# EAGLE design EBR01_1 (EAGLE 7.4.0)
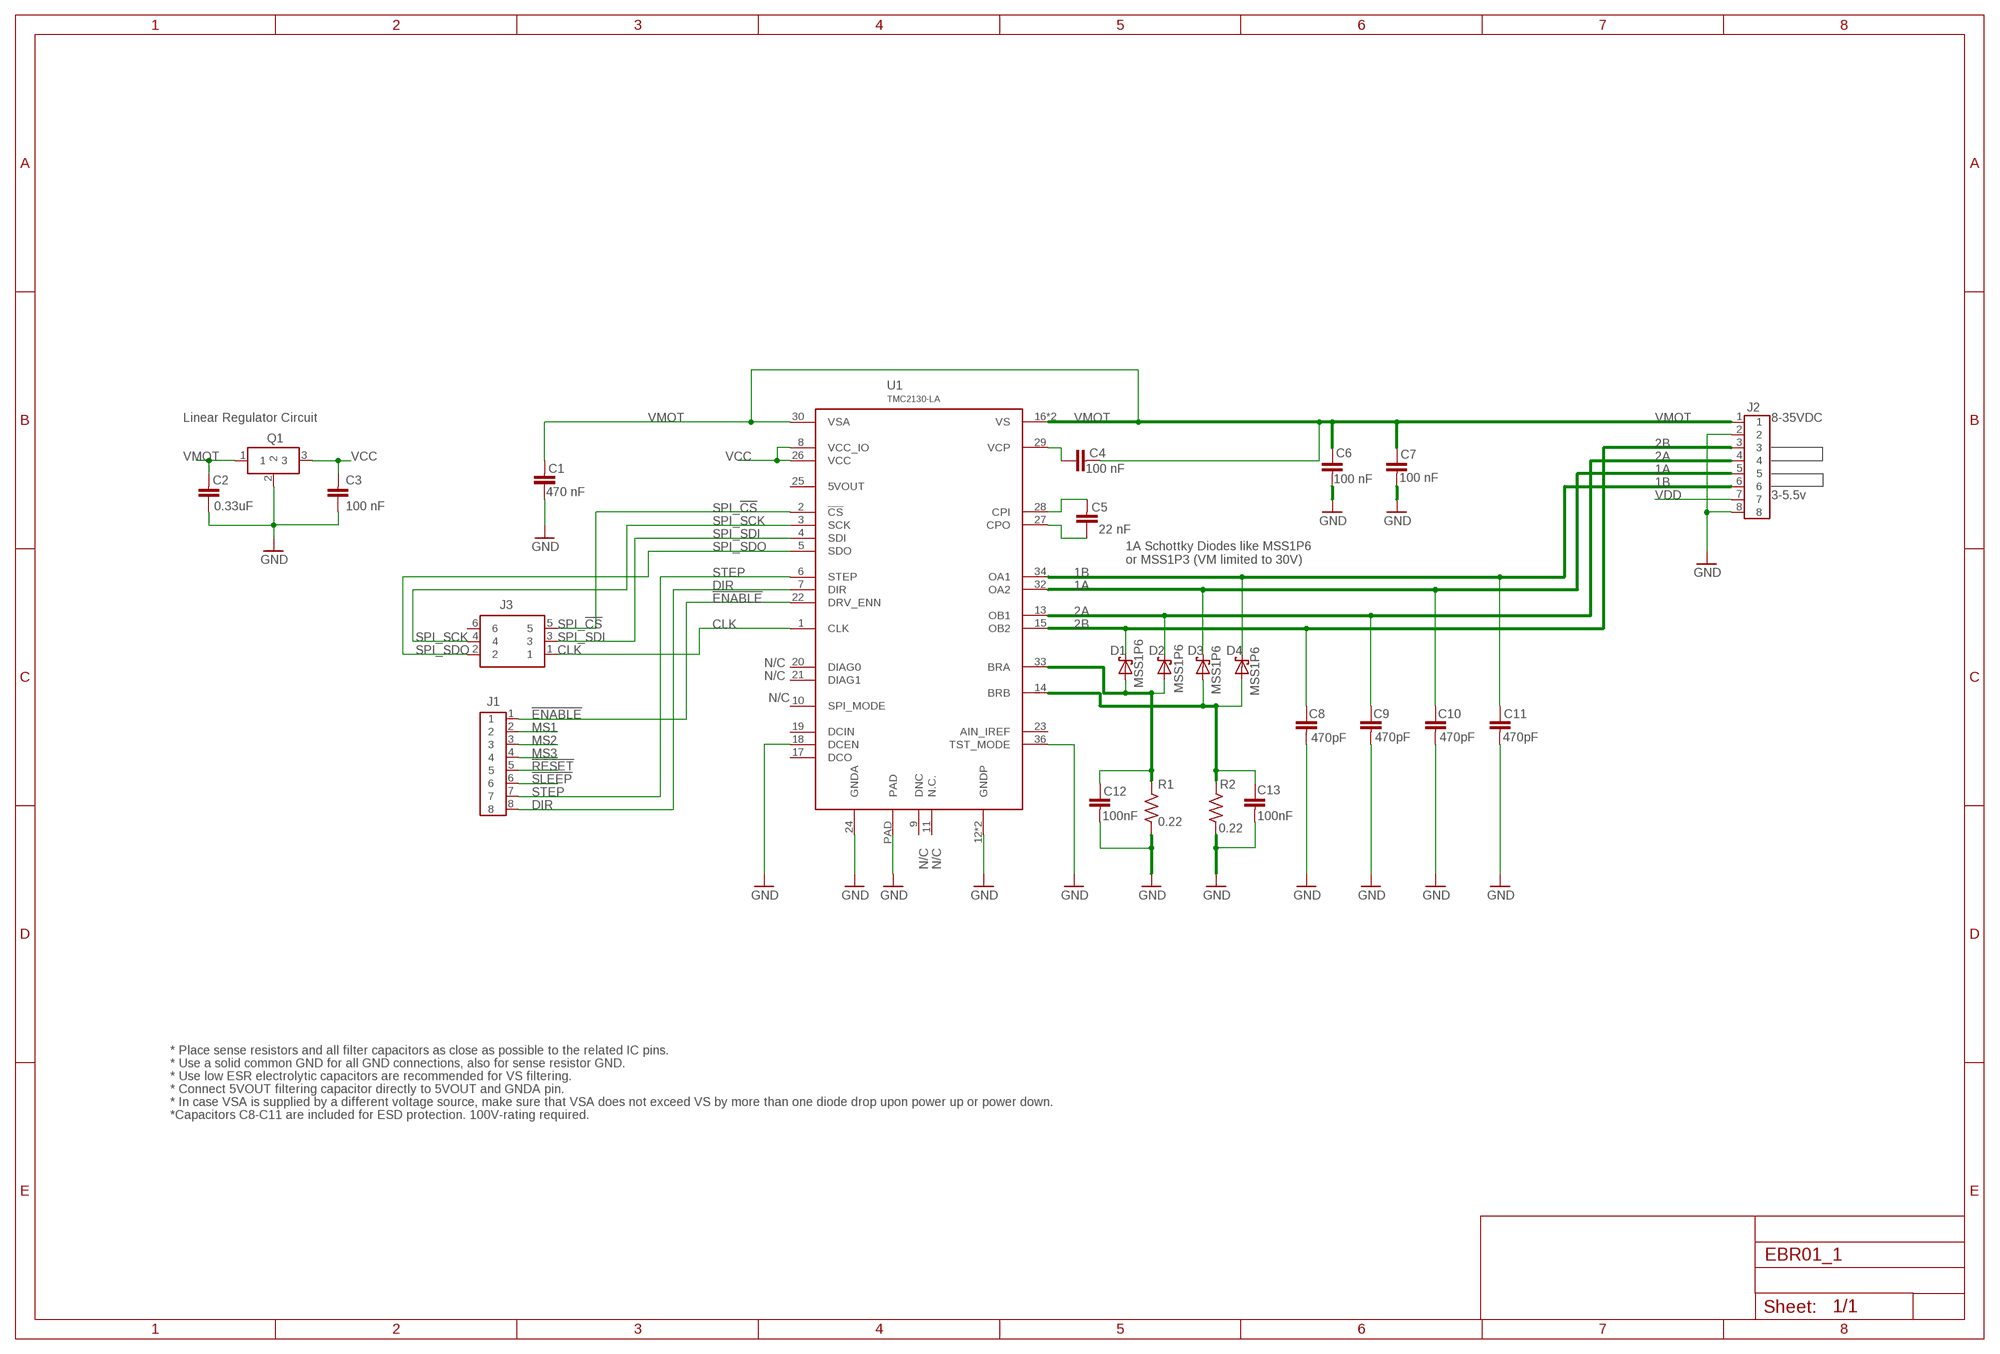
[diagram p0: schematic, sheet 1]

## Parts
C1  470 nF  CPL-CAP-X7R-0603-0.47UF-35V  [C0603]
C2  0.33uF  CPL-CAP-X7R-0603-0.33UF-35V  [C0603]
C3  100 nF  CPL-CAP-X7R-0603-100NF-50V  [C0603]
C4  100 nF  CPL-CAP-X7R-0603-100NF-100V  [C0603]
C5  22 nF  CPL-CAP-X7R-0603-22NF-50V"  [C0603]
C6  100 nF  CPL-CAP-X7R-0603-100NF-100V  [C0603]
C7  100 nF  CPL-CAP-X7R-0603-100NF-100V  [C0603]
C8  470pF  CPL-CAP-X7R-0603-470PF-100V  [C0603]
C9  470pF  CPL-CAP-X7R-0603-470PF-100V  [C0603]
C10  470pF  CPL-CAP-X7R-0603-470PF-100V  [C0603]
C11  470pF  CPL-CAP-X7R-0603-470PF-100V  [C0603]
C12  100nF  CPL-CAP-X7R-0603-100NF-50V  [C0603]
C13  100nF  CPL-CAP-X7R-0603-100NF-50V  [C0603]
D1  MSS1P6  CPL-DIO-MSS1P6-MICROSMP  [MICRO-SMP]
D2  MSS1P6  CPL-DIO-MSS1P6-MICROSMP  [MICRO-SMP]
D3  MSS1P6  CPL-DIO-MSS1P6-MICROSMP  [MICRO-SMP]
D4  MSS1P6  CPL-DIO-MSS1P6-MICROSMP  [MICRO-SMP]
J1  CPL-CON-HEADER-0.1IN-8P-M  [CON-HDR-8POS-MALE]
J2  CPL-CON-HEADER-0.1IN-8P-M  [CON-HDR-8POS-MALE]
J3  CPL-CON-HEADER-0.1IN-2X3P-M  [CON-HDR-2X3P]
Q1  CPL-REG-LIN-5V-0.1A  [SOT-89]
R1  0.22  CPL-RES-1206-0.22-0.5W  [R1206]
R2  0.22  CPL-RES-1206-0.22-0.5W  [R1206]
U1  TMC2130-LA  CPL-MDR-2PHSTEPPER  [QFN36-(5X6)]

## Nets
1A: C10.1 D3.NEG(C) J2.5 U1.32(OA2)
1B: C11.1 D4.NEG(C) J2.6 U1.34(OA1)
2A: C9.1 D2.NEG(C) J2.4 U1.13(OB1)
2B: C8.1 D1.NEG(C) J2.3 U1.15(OB2)
!ENABLE!: J1.1 U1.22(DRV_ENN)
!RESET!: J1.5
!SLEEP!: J1.6
BRA: C12.1 D1.POS(A) D2.POS(A) R1.2 U1.33(BRA)
BRB: C13.1 D3.POS(A) D4.POS(A) R2.2 U1.14(BRB)
CLK: J3.1 U1.1(CLK)
CPI: C5.2 U1.28(CPI)
CPO: C5.1 U1.27(CPO)
DIR: J1.8 U1.7(DIR)
GND: C1.1 C2.1 C3.1 C6.2 C7.2 C8.2 C9.2 C10.2 C11.2 C12.2 C13.2 J2.2 J2.8 Q1.2 R1.1 R2.1 U1.12(GNDP) U1.18(DCEN) U1.24(GNDA) U1.35(GNDP) U1.36(TST_MODE) U1.PAD
MS1: J1.2
MS2: J1.3
MS3: J1.4
SPI_!CS!: J3.5 U1.2(!CS)
SPI_SCK: J3.4 U1.3(SCK)
SPI_SDI: J3.3 U1.4(SDI)
SPI_SDO: J3.2 U1.5(SDO)
STEP: J1.7 U1.6(STEP)
VCC: C3.2 Q1.3 U1.8(VCC_IO) U1.26(VCC)
VCP: C4.1 U1.29(VCP)
VDD: J2.7
VMOT: C1.2 C2.2 C4.2 C6.1 C7.1 J2.1 Q1.1 U1.16(VS) U1.30(VSA) U1.31(VS)
Unconnected: J3.6 U1.9(DNC) U1.10(SPI_MODE) U1.11(N.C.) U1.17(DCO) U1.19(DCIN) U1.20(DIAG0) U1.21(DIAG1) U1.23(AIN_IREF) U1.25(5VOUT)

## Notes on the sheet
- Linear Regulator Circuit | 8-35VDC
- 3-5.5v
- 1A Schottky Diodes like MSS1P6
  or MSS1P3 (VM limited to 30V)
- N/C
- N/C
- N/C
- N/C | N/C
- * Place sense resistors and all filter capacitors as close as possible to the related IC pins.
- * Use a solid common GND for all GND connections, also for sense resistor GND.
- * Use low ESR electrolytic capacitors are recommended for VS filtering.
- * Connect 5VOUT filtering capacitor directly to 5VOUT and GNDA pin.
- * In case VSA is supplied by a different voltage source, make sure that VSA does not exceed VS by more than one diode drop upon power up or power down.
- *Capacitors C8-C11 are included for ESD protection. 100V-rating required.

## Library data of the parts
C1 = TinWhiskers:CPL-CAP-X7R-0603-0.47UF-35V
C2 = TinWhiskers:CPL-CAP-X7R-0603-0.33UF-35V: Capacitor: 0.33uF, 35V, 10%, X7R; Package: 0603 Datasheet: http://product.tdk.com/en/catalog/datasheets/mlcc_commercial_general_en.pdf
C3 C12 C13 = TinWhiskers:CPL-CAP-X7R-0603-100NF-50V: Capacitor: 100nF, 50V, 10%; Package: 0603
C4 C6 C7 = TinWhiskers:CPL-CAP-X7R-0603-100NF-100V: Capacitor: 100nF, 100V, 10%; Package: 0603; Datasheet:
C5 = TinWhiskers:CPL-CAP-X7R-0603-22NF-50V: Capacitor Specs: 22nF, 50V, 10%, Package: 0603
C8-C11 = TinWhiskers:CPL-CAP-X7R-0603-470PF-100V: Capacitor: 470pF, 100V, 5%; Package: 0603 Datasheet: http://www.mouser.com/ds/2/427/vjw1bcbascomseries-223529.pdf
D1-D4 = TinWhiskers:CPL-DIO-MSS1P6-MICROSMP: Diode: Rectifier, 1A, 60V; Package: Micro-SMP; Datasheet: http://www.vishay.com/docs/89018/mss1p6.pdf
J1 J2 = TinWhiskers:CPL-CON-HEADER-0.1IN-8P-M
J3 = TinWhiskers:CPL-CON-HEADER-0.1IN-2X3P-M: Connector: 0.1" Pitch, 2x3P Datasheet: http://www.mouser.com/ds/2/418/NG_CD_825440_G_baseFilename-672958.pdf
Q1 = TinWhiskers:CPL-REG-LIN-5V-0.1A: Voltage Regulator: Vo=5V, Vin,max=30V, Io=0.1A; Package: SOT-89; Datasheet: http://www.mouser.com/ds/2/149/KA78L05A-185602.pdf
R1 R2 = TinWhiskers:CPL-RES-1206-0.22-0.5W: Resistor: 0.22 Ohm, 0.5W, 1%, 100 ppm/C Package: 1206 Datasheet: http://www.mouser.com/ds/2/427/rcwe-244377.pdf
U1 = TinWhiskers:CPL-MDR-2PHSTEPPER: Stepper Driver (Trinamic TMC2130-LA)

## Board
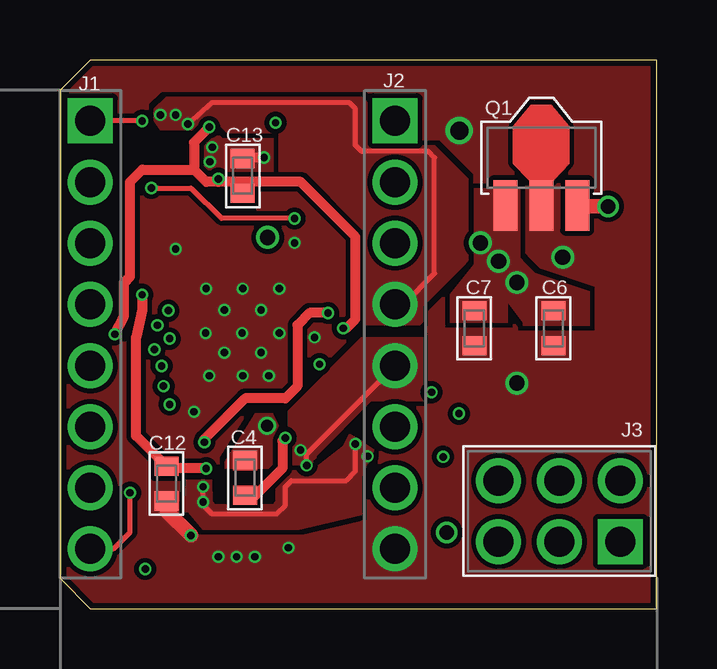
[diagram p1: board, top side]
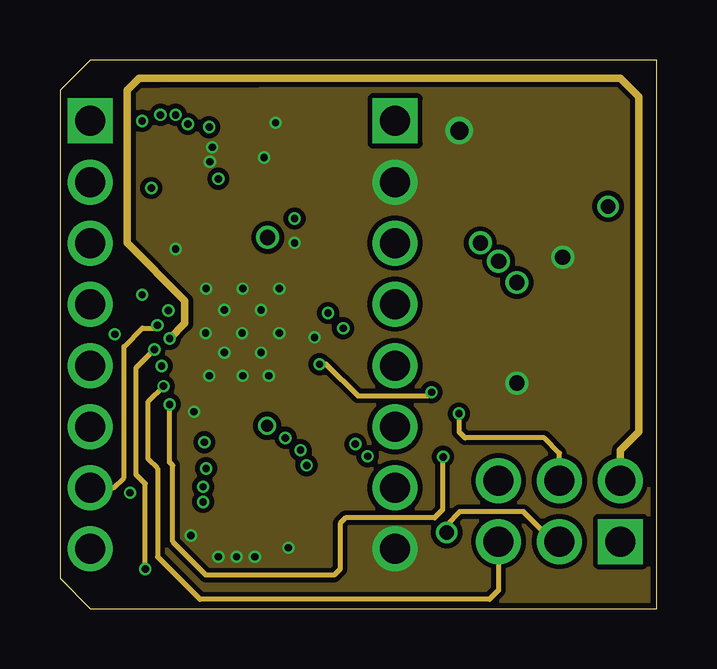
[diagram p2: board, inner layer GND]
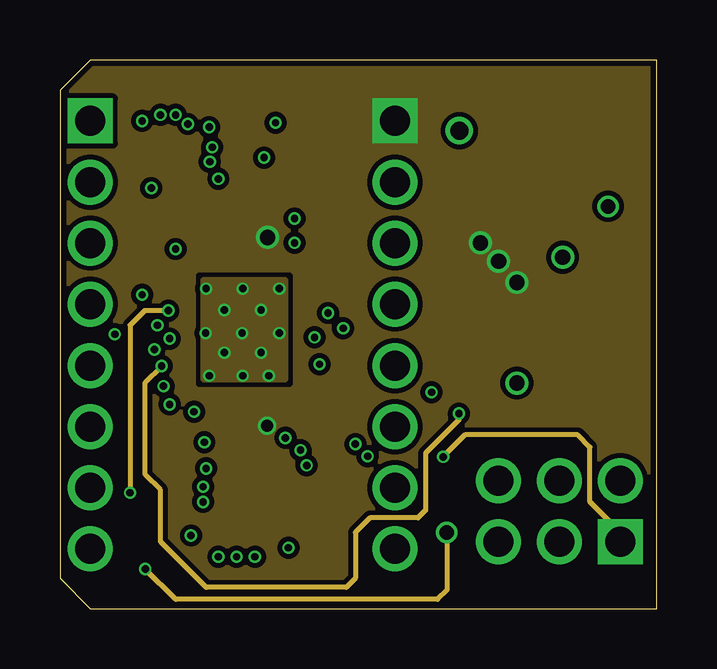
[diagram p3: board, inner layer VMOT]
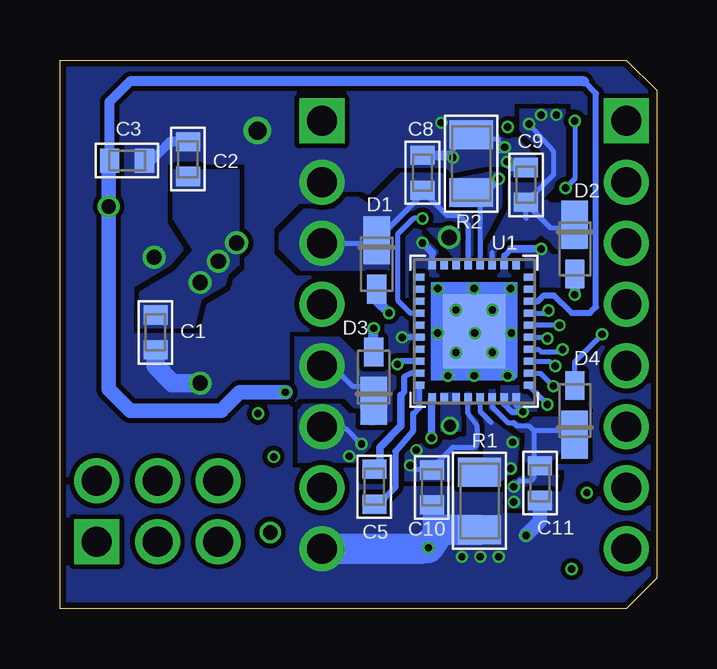
[diagram p4: board, bottom side, seen from below]

Size 24.89 x 22.86 mm. Coordinates in mm from the lower left corner, seen from the top.
Outline: 0,1.27 1.27,0 24.89,0 24.89,22.86 1.27,22.86 0,21.59 0,1.27
Copper layers (1*2*15*16): Top 0.035mm / dielectric 0.2mm / GND 0.0175mm / dielectric 0.3mm / VMOT 0.0175mm / dielectric 0.2mm / Bottom 0.035mm
Design rules "HQPCB_4layer_DRU_no_angle": minimum track width 6mil, minimum drill 12mil, track to track 8mil, track to pad 8mil, pad to pad 6mil, via to via 8mil, smd to smd 0mil, copper to edge 10mil, drill to drill 8mil, minimum pad ring 6mil, minimum via ring 4mil, stop-mask expansion 2mil, vias tented up to drill 100mil, thermal gap 10mil
tKeepout: area 3,7 to 12.2,16.3

### Footprints (pad centres in the part's own frame; a part is rotated, then mirrored left to right if it is on the bottom)
C0603 = smd 0.8 x 1: 1 -0.725,0; 2 0.725,0
MICRO-SMP = smd 2 x 1.1: NEG -1,0 | smd 1.2 x 0.8: POS 1.04,0
CON-HDR-8POS-MALE = drill 1.25 square: 1 -8.89,0 | drill 1.25: 2 -6.34,0; 3 -3.8,0; 4 -1.26,0; 5 1.31,0; 6 3.85,0; 7 6.39,0; 8 8.93,0
CON-HDR-2X3P = drill 1.25 square: 1 -2.54,1.27 | drill 1.25: 2 -2.54,-1.27; 3 0,1.27; 4 0,-1.27; 5 2.54,1.27; 6 2.54,-1.27
SOT-89 = smd 1 x 2.1: 1 -1.5,-2; 2 0,-2; 3 1.5,-2
R1206 = smd 1.2 x 1.8: 1 -1.2,0; 2 1.2,0
QFN36-(5X6) = smd 0.45 x 0.3: 1 -2.3,2.25; 2 -2.3,1.75; 3 -2.3,1.25; 4 -2.3,0.75; 5 -2.3,0.25; 6 -2.3,-0.25; 7 -2.3,-0.75; 8 -2.3,-1.25; 9 -2.3,-1.75; 10 -2.3,-2.25; 19 2.3,-2.25; 20 2.3,-1.75; 21 2.3,-1.25; 22 2.3,-0.75; 23 2.3,-0.25; 24 2.3,0.25; 25 2.3,0.75; 26 2.3,1.25; 27 2.3,1.75; 28 2.3,2.25 | smd 0.3 x 0.45: 11 -1.75,-2.8; 12 -1.25,-2.8; 13 -0.75,-2.8; 14 -0.25,-2.8; 15 0.25,-2.8; 16 0.75,-2.8; 17 1.25,-2.8; 18 1.75,-2.8; 29 1.75,2.8; 30 1.25,2.8; 31 0.75,2.8; 32 0.25,2.8; 33 -0.25,2.8; 34 -0.75,2.8; 35 -1.25,2.8; 36 -1.75,2.8 | smd 2.6 x 3.1: PAD 0,0

### Placement (x,y rotation side)
C1  20.91,11.51 90 bottom
C2  19.56,18.73 270 bottom
C3  22.1,18.67 180 bottom
C4  7.71,5.45 90 top
C5  11.79,5.08 270 bottom
C6  20.57,11.68 270 top
C7  17.27,11.68 270 top
C8  9.78,18.16 90 bottom
C9  5.46,17.65 90 bottom
C10  9.39,5.05 270 bottom
C11  4.88,5.23 270 bottom
C12  4.44,5.21 270 top
C13  7.62,18.03 90 top
D1  11.68,14.35 270 bottom
D2  3.43,14.99 270 bottom
D3  11.81,9.65 90 bottom
D4  3.43,8.26 90 bottom
J1  1.27,11.43 270 top
J2  13.97,11.43 270 top
J3  20.83,4.06 180 top
Q1  20.07,18.8 0 top
R1  7.4,4.49 90 bottom
R2  7.75,18.54 270 bottom
U1  7.62,11.56 180 bottom

### Tracks (layer width: path | path; a pad name or v marks a point on that pad's centre or on a via)
1A  (via drill 0.3)
  Top 0.203: v10.29,5.97 10.29,6.44 J2.5
  Bottom 0.203: U1.32 7.87,8.13 7.49,7.62 7.49,6.86 7.62,6.73 8.51,6.73 9.39,5.85 C10.1 10.1,5.78 v10.29,5.97 | D3.NEG 11.68,9.27 12.7,9.27 13.46,10.03 13.88,10.03
  other vias: 10.03,6.6
  pour Bottom (rank 2, no thermals): 7.75,9.02 8,9.02 8,7.24 8.26,7.11 9.91,6.86 10.54,6.48 10.54,5.33 8.64,5.33 8.51,5.46 8.51,6.48 7.37,6.48 7.37,7.75 7.75,8.13
  pour Top (rank 2, no thermals): 10.67,6.35 10.67,5.84 10.41,5.59 10.03,5.59 9.53,6.1 9.53,8.26 12.57,11.3 15.11,11.3 15.11,8.64 12.95,8.64
  pour Bottom (rank 3, no thermals): 12.45,10.54 13.21,11.3 15.11,11.3 15.11,8.64 12.95,8.64 11.94,7.62 10.79,7.87 10.79,9.91 11.43,10.54
1B  (via drill 0.3)
  Top 0.203: v5.97,5.08 5.97,4.32 6.35,3.94 9.02,3.94 9.4,4.32 9.4,5.08 9.65,5.33 11.94,5.33 12.32,5.71 v12.32,6.86
  Bottom 0.203: 6.86,8.74 U1.34 6.87,8.39 6.22,7.75 5.97,7.75 5.84,7.62 5.33,7.62 5.16,7.44 5.13,7.44 | 5.13,7.44 3.74,7.44 D4.NEG | v12.32,6.86 12.95,7.49 13.88,7.49 J2.6 | v5.97,5.08 5.71,5.33 5.26,5.33 5.13,5.46 5.13,5.7 C11.1 5.13,6.21 5.13,7.44
  other vias: 12.83,6.35 5.97,4.45
  pour Bottom (no thermals): 5.33,5.59 4.06,5.59 4.19,5.08 5.46,5.08 5.59,4.19 6.22,4.19 6.22,5.21 5.84,5.51 5.33,5.51
  pour Top (no thermals): 6.32,5.33 5.26,5.33 5.21,4.06 5.33,4.06 5.97,3.3 9.04,3.33 9.91,3.3 12.57,3.94 12.57,5.59 13.08,6.6 12.06,7.24 11.81,6.73 10.67,5.84 10.54,5.71 9.65,5.71 9.02,5.08 9.02,4.45 8.89,4.32 6.48,4.32 6.35,4.45
  pour Bottom (no thermals): 11.81,6.86 11.05,6.86 11.05,7.75 11.43,8.13 12.83,8.13 13.21,8.51 14.73,8.51 14.99,8.26 14.99,6.1 12.57,6.1
  pour Bottom (rank 2, no thermals): 6.6,9.02 7.11,9.02 7.11,8.13 6.35,7.37 5.59,7.37 5.46,7.24 5.46,6.22 4.45,6.22 3.68,6.99 3.68,7.87 5.97,7.87 6.6,8.51
2A  (via drill 0.3)
  Top 0.203: J2.4 14.34,12.69 15.62,13.97 15.62,18.8 15.37,19.05 12.57,19.05 12.32,19.3 12.32,20.83 12.06,21.08 6.35,21.08 v5.33,20.19
  Bottom 0.203: U1.13 6.87,14.85 | 5.46,16.26 C9.1 | C9.1 5.46,16.89 4.45,15.88 3.95,15.88 D2.NEG | v5.33,20.19 4.32,19.05 4.32,18.07 C9.1
  other vias: 4.83,20.57 4.19,20.57
  pour Bottom (no thermals): 6.73,14.35 6.99,14.35 6.99,14.99 6.1,16.64 4.83,16.64 4.83,15.75 5.21,15.37 6.1,15.37 6.73,14.86
  pour Bottom (no thermals): 4.57,17.02 6.22,17.02 6.22,15.88 5.08,15.88 4.19,14.99 3.05,14.99 3.05,16.89 4.45,16.89
  pour Bottom (no thermals): 6.22,17.02 6.22,17.65 6.1,17.78 4.95,17.78 4.83,17.91 4.83,19.05 5.71,19.94 5.71,20.83 3.81,20.83 3.81,18.03 4.83,17.02
  pour Top (rank 2, no thermals): 5.84,19.94 4.19,19.94 3.94,20.32 3.94,20.83 4.45,21.34 12.57,21.34 12.95,20.95 12.95,19.43 13.08,19.3 15.62,19.3 17.02,17.91 17.02,14.48 15.11,12.57 15.11,11.94 14.99,11.81 12.7,11.81 12.7,15.62 11.18,17.27 10.29,18.16 9.14,18.16 9.14,19.81 6.99,19.81 6.48,20.32 6.1,20.32 5.84,20.07
2B
  Bottom 0.203: J2.3 11.8,15.23 D1.NEG 9.78,17.26 | C8.1 9.78,17.26 | 9.78,17.26 9.64,17.26 8.76,16.38 8.26,16.38 7.87,16 U1.15
  pour Bottom (no thermals): 13.46,16.64 14.73,16.64 15.75,15.62 15.75,14.99 14.86,14.1 11.18,14.1 11.18,16.26 12.45,17.14 12.95,17.14
  pour Bottom (no thermals): 12.19,16.64 10.67,18.16 9.02,18.16 8.76,17.91 8.76,17.14 8.89,17.02 9.65,17.02 11.18,15.49 12.19,15.49
  pour Bottom (rank 2, no thermals): 7.62,14.22 8.13,14.22 8.13,15.88 8.26,16 9.27,16 10.67,17.4 10.67,17.53 10.03,18.16 9.4,18.16 8.76,17.53 8.76,16.76 8.64,16.64 7.87,16.64 7.49,16.26 7.49,15.75 7.62,15.62
!ENABLE!  (via drill 0.3)
  Top 0.203: v3.43,20.32 J1.1 | v9.78,16.26 6.73,16.26 5.46,17.53 v3.81,17.53
  Bottom 0.203: U1.22 10.28,12.31 10.79,12.83 10.79,15.62 10.16,16.26 v9.78,16.26 | v3.43,20.32 3.43,17.91 v3.81,17.53
BRA  (via drill 0.3)
  Top 0.203: 4.53,5.84 C12.1
  Top 0.406: v6.1,5.84 4.53,5.84 | C12.1 3.17,7.2 3.17,11.3 3.43,12.45 v3.43,13.08 | v11.18,12.32 10.41,12.32 9.91,11.81 9.91,9.27 9.4,8.76 7.72,8.76 6.02,7.06 v6.02,6.93
  Bottom 0.203: 6.91,6.18 R1.2 | 6.91,7.75 7.37,8.2 U1.33 | 3.3,13.82 D2.POS
  Bottom 0.406: D1.POS 11.68,12.83 v11.18,12.32 | D2.POS v3.43,13.08
  Bottom 0.61: 7.25,5.84 R1.2
  pour Bottom (no thermals): 7.24,8.13 5.84,7.11 5.71,7.11 5.84,5.84 6.6,5.21 8.26,5.21 8.26,6.22 7.24,6.22
BRB  (via drill 0.3)
  Top 0.406: v6.22,20.07 5.59,19.43 5.59,18.29 | 5.59,18.29 3.43,18.29 2.92,17.78 2.92,13.84 2.67,13.59 2.67,12.19 v2.29,11.43 | 7.49,17.78 10.03,17.78 12.32,15.49 12.32,12.06 11.94,11.68 v11.81,11.68 | C13.1 7.71,17.31 R2.2 7.75,17.53 7.49,17.78 | 7.49,17.78 6.6,17.78 | 6.6,17.78 6.1,17.78 5.59,18.29 | v6.6,17.91 6.6,17.78
  Bottom 0.203: D4.POS 3.43,10.29 v2.29,11.43 | U1.14 7.37,16.96 | 7.37,16.96 R2.2 | 7.37,16.96 7.37,17.52 7.12,17.52
  Bottom 0.406: D3.POS v11.81,11.68 | 7.12,17.52 v6.6,17.91
  pour Bottom (rank 3, no thermals): 7.11,14.73 7.49,14.73 7.62,16.51 7.75,16.64 8.51,16.64 8.64,16.76 8.64,17.78 8.51,17.91 6.6,18.29 6.35,18.03 6.35,16.64 7.11,14.86
CLK  (via drill 0.3)
  GND 0.203: v15.98,6.33 15.95,6.3 15.95,4.12 15.62,3.79 11.91,3.79 11.68,3.56 11.68,1.65 11.43,1.4 6.1,1.4 4.7,2.79 4.7,5.97 4.57,6.1 v4.57,8.51
  VMOT 0.203: J3.1 23.37,3.17 22.1,4.45 22.1,6.73 21.59,7.24 16.89,7.24 v15.98,6.33
  Bottom 0.203: U1.1 5.32,9.26 v4.57,8.51
CPI
  Bottom 0.203: C5.2 11.61,4.36
  Bottom 0.254: U1.28 9.92,8.37 10.16,8.13 10.16,7.42 10.91,6.54 10.91,5.05 11.61,4.36
CPO
  Bottom 0.203: 11.56,5.93 C5.1
  Bottom 0.254: 10.67,8.89 10.54,9.02 10.54,9.65 10.26,9.81 U1.27
  Bottom 0.305: 11.56,5.93 11.56,6.73 10.67,7.62 10.67,8.89
DIR  (via drill 0.3)
  Top 0.203: J1.8 2.25,2.5 2.92,3.17 v2.92,4.83
  VMOT 0.203: v2.92,4.83 2.92,11.81 3.53,12.42 v4.52,12.42
  Bottom 0.203: 5.31,12.32 U1.7 4.63,12.31 v4.52,12.42
GND  (via drill 0.3, 0.64, 0.76)
  Top 0.203: 7.66,18.8 C13.2
  Top 0.406: v8.51,18.8 7.66,18.8
  Top 0.61: C12.2 4.44,4.07 v5.46,3.05
  Bottom 0.203: 9.14,4.08 C10.2 | v10.61,11.31 v10.62,11.3 | v16.66,19.91 16.66,19.91 | v7.62,13.34 U1.PAD 7.62,11.51 v7.59,11.48 | v8.51,18.8 8.51,19.3 8.07,19.74 R2.1 7.56,19.56 6.6,19.56 6.6,19.05 | 5.33,18.41 5.37,18.38 C9.2 5.5,18.41
  Bottom 0.254: 6.37,8.66 U1.35 6.37,8.53 6.04,8.2 v5.59,8.2 5.87,8.49 U1.36 | U1.12 6.37,14.71 6.1,14.99 | U1.18 9.37,14.83 | U1.24 v10.61,11.31
  Bottom 0.305: 6.1,14.99 v4.83,14.99 | 9.37,14.83 v9.78,15.24
  Bottom 0.406: 5.5,18.41 6.04,18.41 v6.25,18.62 | C8.2 8.6,18.89 v8.51,18.8 | C2.1 20.3,19.45 21.08,18.67 C3.1
  Bottom 0.61: C11.2 4.88,3.63 v5.46,3.05
  Bottom 0.762: C1.1 20.91,10.11 20.19,9.4 v19.05,9.4 | v9.53,2.54 9.39,2.67 C10.2
  Bottom 1.27: J2.8 9.82,2.5 v9.53,2.54 9.03,3.29 R1.1
  other vias: 20.96,14.64 7.62,9.7 8.71,9.7 6.22,9.7 9.14,11.48 6.07,11.48 6.1,13.34 9.14,13.34 6.35,19.23 6.86,12.45 8.38,12.45 8.38,10.67 6.86,10.67 6.6,2.16 7.37,2.16 8.13,2.16 8.99,20.24
  pour GND (isolate 0.203, no thermals): 0,21.59 24.89,21.72 24.89,0.13 1.27,0 0,1.27
  pour Bottom (isolate 0.254, no thermals): 16,19.05 21.8,19.03 21.8,21.32 17.02,21.34 16,20.32
  pour Top (isolate 0.203, no thermals): 19.49,17.53 20.64,17.53 20.64,15.62 21.65,14.67 21.65,14.16 20.07,14.16 19.49,14.8
  pour Top (isolate 0.203, no thermals): 19.3,11.43 21.84,11.43 21.84,10.16 19.81,8.89 18.54,8.89 18.54,9.91 19.3,10.16
  pour Top (isolate 0.203, no thermals): 18.54,11.43 18.54,10.41 19.56,9.91 19.56,8.89 18.54,8.89 16,10.41 16,11.43
  pour Bottom (no thermals): 6.6,20.7 10.03,20.7 10.41,20.32 10.41,18.41 6.48,18.41 5.21,18.8 6.1,19.56 6.35,19.81
  pour Bottom (no thermals): 5.97,1.91 6.35,1.52 8.64,1.52 9.53,2.03 8.89,2.79 8.51,3.17 8.51,3.68 8.38,3.81 6.48,3.81 6.35,3.68 6.35,3.05 5.97,2.67
  pour Bottom (no thermals): 5.46,8.13 6.1,8.13 6.48,8.51 6.48,9.02 5.46,9.02 5.33,8.89 5.33,8.26
  pour Top (rank 4, no thermals): 3.43,17.91 9.91,17.78 11.68,15.24 11.68,10.92 9.14,8.38 8.38,8.38 6.48,6.48 4.57,6.48 3.68,7.37 3.68,13.72 3.43,13.97
  pour VMOT: 5.97,13.72 9.4,13.72 9.4,9.53 5.97,9.53
  pour Top (rank 5, no thermals): 0,22.86 24.89,22.86 24.89,0 0,0
  pour Bottom (rank 5, no thermals): 0,22.86 24.89,22.86 24.89,0 0,0
SPI_!CS!  (via drill 0.3)
  GND 0.203: v4.32,9.27 3.68,8.64 3.68,6.22 4.06,5.84 4.06,2.16 5.84,0.38 17.91,0.38 18.29,0.76 J3.5
  Bottom 0.203: U1.2 5.22,9.8 4.85,9.8 v4.32,9.27
SPI_SCK  (via drill 0.3)
  GND 0.203: J3.4 20.83,6.48 20.19,7.11 16.89,7.11 16.64,7.37 v16.64,8.13
  VMOT 0.203: v4.24,10.11 3.56,9.42 3.56,5.59 4.19,4.95 4.19,2.79 6.1,0.89 11.94,0.89 12.32,1.27 12.32,3.17 12.93,3.79 14.94,3.79 15.24,4.09 15.24,6.48 16.64,7.87 v16.64,8.13
  Bottom 0.203: U1.3 5.3,10.29 4.45,10.29 4.27,10.11 v4.24,10.11
SPI_SDI  (via drill 0.3, 0.6)
  GND 0.203: J3.3 20.57,2.79 19.33,4.04 16.66,4.04 16.13,3.5 v16.13,3.17 | v3.94,10.79 3.17,10.03 3.17,5.59 3.56,5.21 v3.56,1.65
  VMOT 0.203: v16.13,3.17 16.13,0.76 15.75,0.38 4.83,0.38 v3.56,1.65
  Bottom 0.203: U1.4 4.94,10.81 4.83,10.69 4.04,10.69 v3.94,10.79
SPI_SDO  (via drill 0.3)
  GND 0.305: J3.2 23.37,6.6 24.13,7.37 24.13,21.34 23.37,22.1 3.3,22.1 2.79,21.59 2.79,15.24 5.21,12.83 5.21,11.89 v4.57,11.25
  Bottom 0.203: U1.5 4.63,11.31 v4.57,11.25
STEP  (via drill 0.3)
  GND 0.203: J1.7 2.25,5.04 2.67,5.46 2.67,10.92 3.43,11.68 3.94,11.68 v4.06,11.81
  Bottom 0.203: v4.06,11.81 U1.6
VCC  (via drill 0.3, 0.6)
  Top 0.203: Q1.3 21.57,16.79 21.59,16.76
  Top 0.61: 21.59,16.76 v22.86,16.76
  GND 0.203: v10.82,10.19 11.1,10.19 12.42,8.87 15.34,8.87 v15.49,9.02
  Bottom 0.203: 18.16,8.26 18.03,8.38
  Bottom 0.254: U1.8 4.97,12.81 4.72,13.06 4.29,13.06 3.56,12.32 2.79,12.32 2.54,12.57 2.54,21.46 3.05,21.97 | U1.26 10.7,10.31 v10.82,10.19
  Bottom 0.406: 3.05,21.97 21.97,21.97 22.82,21.12 C3.2
  Bottom 0.61: 18.16,8.26 21.97,8.26 22.86,9.14 v22.86,16.76 22.86,18.63 C3.2 | v15.49,9.02 17.4,9.02 18.03,8.38
VCP  (via drill 0.3)
  Top 0.203: C4.1 8.15,4.72
  Top 0.406: 8.15,4.72 9.27,5.84 9.27,6.99 v9.4,7.11
  Bottom 0.025: 9.4,8.73 U1.29
  Bottom 0.305: 9.4,8.73 v9.4,7.11
VMOT  (via drill 0.51, 0.64)
  other vias: 18.29,14.48 8.66,15.47 8.64,7.62 17.53,15.24 19.05,13.59
  pour VMOT (isolate 0.203, rank 2, no thermals): 0,22.86 24.77,22.86 24.89,0 1.27,0 0,1.27
  pour Top (isolate 0.203, no thermals): 19.18,17.53 19.18,13.84 17.85,13.83 17.27,14.34 17.27,17.53
  pour Top (isolate 0.203, no thermals): 16.26,13.08 16.26,11.94 18.67,11.94 18.67,13.08 19.04,14.94 17.77,14.94 arc0
  pour Bottom (isolate 0.203, no thermals): 20.19,18.29 20.19,16.26 18.41,13.46 17.4,14.35 17.4,18.29
  pour Bottom (isolate 0.203, no thermals): 19.3,11.68 21.59,11.68 21.57,13.2 20.06,14.1 19.3,14.99 18.54,15.49 17.53,14.99 18.03,13.46 19.02,12.87
  pour Top (isolate 0.203, no thermals): 22.1,11.81 22.1,13.21 19.81,13.97 18.8,14.99 17.78,14.99 17.78,13.97 19.3,11.94 19.31,11.81
  pour Bottom (isolate 0.203, no thermals): 9.65,15.88 8.13,15.88 8.13,14.73 8.13,14.16 8.6,14.15 8.6,14.81
  pour Top (isolate 0.203, no thermals): 6.86,5.84 8.89,5.84 8.89,7.11 9.14,7.62 8.89,8.13 8.13,8.13 6.86,6.1
  pour Bottom (isolate 0.203, no thermals): 8.23,8.89 9.02,8.89 9.02,7.49 8.26,7.49 8.26,7.87